# EAGLE design xmos1 (EAGLE 7.6.0)
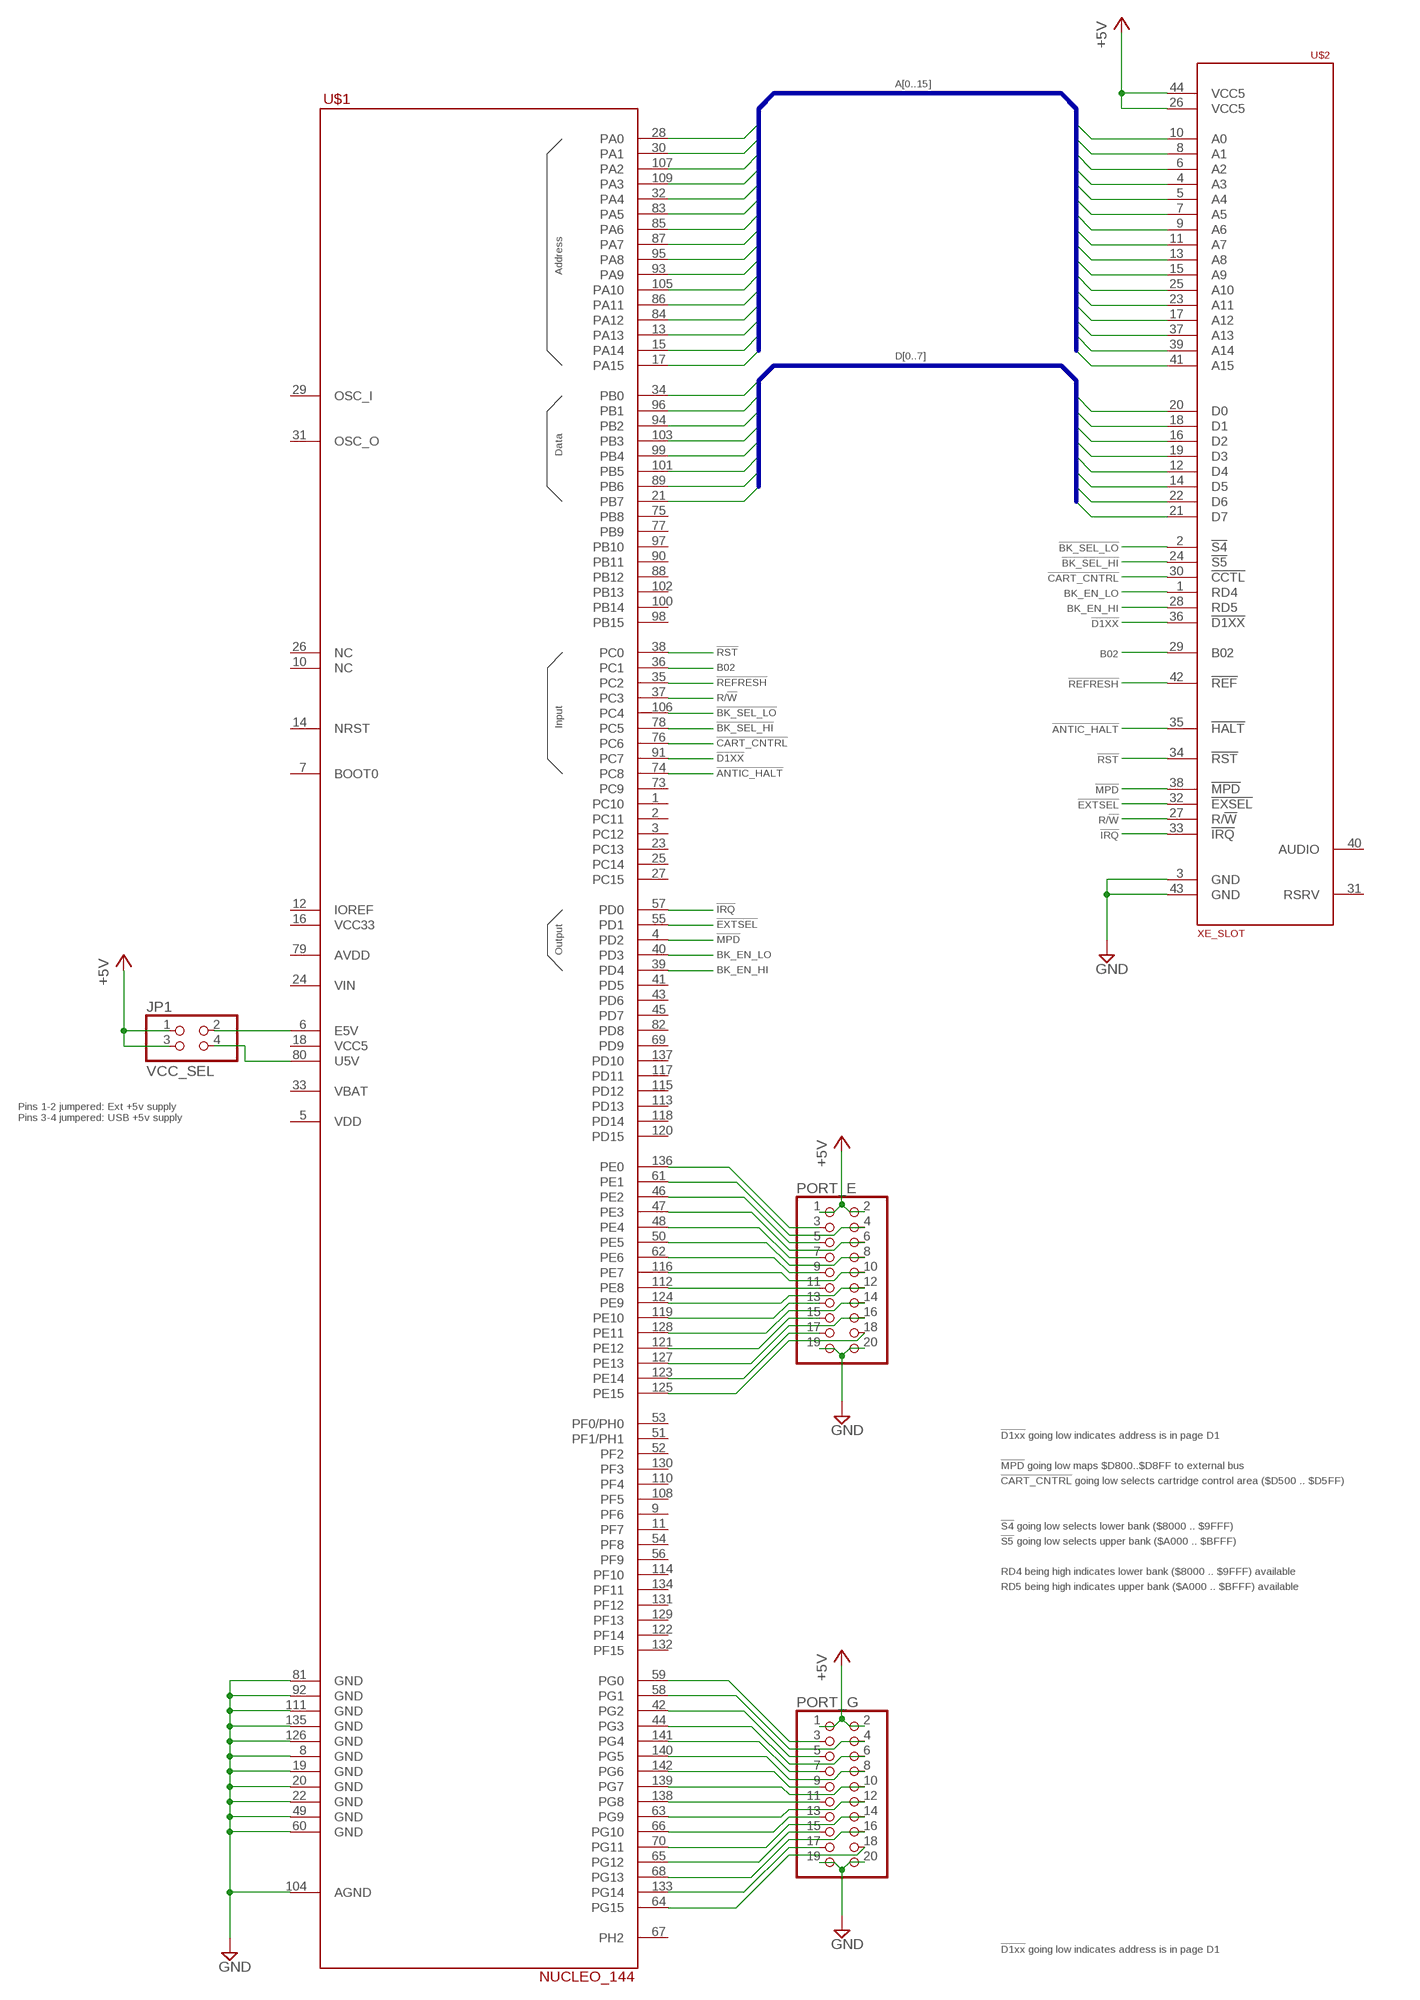
[diagram p0: schematic, sheet 1]

## Parts
JP1  VCC_SEL  PINHD-2X2  [2X02]
PORT_E  PINHD-2X10  [2X10]
PORT_G  PINHD-2X10  [2X10]
U$1  NUCLEO_144  [NUCLEO_144]
U$2  XE_SLOT  [XE_SLOT]

## Nets
!ANTIC_HALT!: U$1.74(PC8) U$2.35(!HALT!)
!BK_SEL_HI!: U$1.78(PC5) U$2.24(!S5!)
!BK_SEL_LO!: U$1.106(PC4) U$2.2(!S4!)
!CART_CNTRL!: U$1.76(PC6) U$2.30(!CCTL!)
!D1XX!: U$1.91(PC7) U$2.36(!D1XX!)
!EXTSEL!: U$1.55(PD1) U$2.32(!EXSEL!)
!IRQ!: U$1.57(PD0) U$2.33(!IRQ!)
!MPD!: U$1.4(PD2) U$2.38(!MPD!)
!REFRESH!: U$1.35(PC2) U$2.42(!REF!)
!RST!: U$1.38(PC0) U$2.34(!RST!)
+5V: JP1.1 JP1.3 PORT_E.1 PORT_E.2 PORT_G.1 PORT_G.2 U$2.26(VCC5) U$2.44(VCC5)
A0: U$1.28(PA0) U$2.10(A0)
A1: U$1.30(PA1) U$2.8(A1)
A2: U$1.107(PA2) U$2.6(A2)
A3: U$1.109(PA3) U$2.4(A3)
A4: U$1.32(PA4) U$2.5(A4)
A5: U$1.83(PA5) U$2.7(A5)
A6: U$1.85(PA6) U$2.9(A6)
A7: U$1.87(PA7) U$2.11(A7)
A8: U$1.95(PA8) U$2.13(A8)
A9: U$1.93(PA9) U$2.15(A9)
A10: U$1.105(PA10) U$2.25(A10)
A11: U$1.86(PA11) U$2.23(A11)
A12: U$1.84(PA12) U$2.17(A12)
A13: U$1.13(PA13) U$2.37(A13)
A14: U$1.15(PA14) U$2.39(A14)
A15: U$1.17(PA15) U$2.41(A15)
B02: U$1.36(PC1) U$2.29(B02)
BK_EN_HI: U$1.39(PD4) U$2.28(RD5)
BK_EN_LO: U$1.40(PD3) U$2.1(RD4)
D0: U$1.34(PB0) U$2.20(D0)
D1: U$1.96(PB1) U$2.18(D1)
D2: U$1.94(PB2) U$2.16(D2)
D3: U$1.103(PB3) U$2.19(D3)
D4: U$1.99(PB4) U$2.12(D4)
D5: U$1.101(PB5) U$2.14(D5)
D6: U$1.89(PB6) U$2.22(D6)
D7: U$1.21(PB7) U$2.21(D7)
GND: PORT_E.19 PORT_E.20 PORT_G.19 PORT_G.20 U$1.8(GND) U$1.19(GND) U$1.20(GND) U$1.22(GND) U$1.49(GND) U$1.60(GND) U$1.81(GND) U$1.92(GND) U$1.104(AGND) U$1.111(GND) U$1.126(GND) U$1.135(GND) U$2.3(GND) U$2.43(GND)
N$1: JP1.2 U$1.6(E5V)
N$2: JP1.4 U$1.80(U5V)
N$3: PORT_E.3 U$1.136(PE0)
N$4: PORT_E.4 U$1.61(PE1)
N$5: PORT_E.5 U$1.46(PE2)
N$6: PORT_E.6 U$1.47(PE3)
N$7: PORT_E.7 U$1.48(PE4)
N$8: PORT_E.8 U$1.50(PE5)
N$9: PORT_E.9 U$1.62(PE6)
N$10: PORT_E.10 U$1.116(PE7)
N$11: PORT_E.11 U$1.112(PE8)
N$12: PORT_E.12 U$1.124(PE9)
N$13: PORT_E.13 U$1.119(PE10)
N$14: PORT_E.14 U$1.128(PE11)
N$15: PORT_E.15 U$1.121(PE12)
N$16: PORT_E.16 U$1.127(PE13)
N$17: PORT_E.17 U$1.123(PE14)
N$18: PORT_E.18 U$1.125(PE15)
N$19: PORT_G.3 U$1.59(PG0)
N$20: PORT_G.4 U$1.58(PG1)
N$21: PORT_G.5 U$1.42(PG2)
N$22: PORT_G.6 U$1.44(PG3)
N$23: PORT_G.7 U$1.141(PG4)
N$24: PORT_G.8 U$1.140(PG5)
N$25: PORT_G.9 U$1.142(PG6)
N$26: PORT_G.11 U$1.138(PG8)
N$28: PORT_G.12 U$1.63(PG9)
N$29: PORT_G.13 U$1.66(PG10)
N$30: PORT_G.14 U$1.70(PG11)
N$31: PORT_G.15 U$1.65(PG12)
N$32: PORT_G.16 U$1.68(PG13)
N$33: PORT_G.17 U$1.133(PG14)
N$34: PORT_G.18 U$1.64(PG15)
PORT_G: PORT_G.10 U$1.139(PG7)
R/!W!: U$1.37(PC3) U$2.27(R/!W!)
Unconnected: U$1.1(PC10) U$1.2(PC11) U$1.3(PC12) U$1.5(VDD) U$1.7(BOOT0) U$1.9(PF6) U$1.10(NC) U$1.11(PF7) U$1.12(IOREF) U$1.14(NRST) U$1.16(VCC33) U$1.18(VCC5) U$1.23(PC13) U$1.24(VIN) U$1.25(PC14) U$1.26(NC) U$1.27(PC15) U$1.29(OSC_I) U$1.31(OSC_O) U$1.33(VBAT) U$1.41(PD5) U$1.43(PD6) U$1.45(PD7) U$1.51(PF1/PH1) U$1.52(PF2) U$1.53(PF0/PH0) U$1.54(PF8) U$1.56(PF9) U$1.67(PH2) U$1.69(PD9) U$1.73(PC9) U$1.75(PB8) U$1.77(PB9) U$1.79(AVDD) U$1.82(PD8) U$1.88(PB12) U$1.90(PB11) U$1.97(PB10) U$1.98(PB15) U$1.100(PB14) U$1.102(PB13) U$1.108(PF5) U$1.110(PF4) U$1.113(PD13) U$1.114(PF10) U$1.115(PD12) U$1.117(PD11) U$1.118(PD14) U$1.120(PD15) U$1.122(PF14) U$1.129(PF13) U$1.130(PF3) U$1.131(PF12) U$1.132(PF15) U$1.134(PF11) U$1.137(PD10) U$2.31(RSRV) U$2.40(AUDIO)

## Buses
A[0..15]
D[0..7]

## Notes on the sheet
- Address
- Data
- Input
- Output
- Pins 1-2 jumpered: Ext +5v supply
  Pins 3-4 jumpered: USB +5v supply
- !D1xx! going low indicates address is in page D1
- !MPD! going low maps $D800..$D8FF to external bus
- !CART_CNTRL! going low selects cartridge control area ($D500 .. $D5FF)
- !S4! going low selects lower bank ($8000 .. $9FFF)
- !S5! going low selects upper bank ($A000 .. $BFFF)
- RD4 being high indicates lower bank ($8000 .. $9FFF) available
- RD5 being high indicates upper bank ($A000 .. $BFFF) available
- !D1xx! going low indicates address is in page D1

## Library data of the parts
JP1 = pinhead:PINHD-2X2: PIN HEADER
PORT_E PORT_G = pinhead:PINHD-2X10: PIN HEADER
U$1 = pbxl:NUCLEO_144
U$2 = pbxl:XE_SLOT

## Board
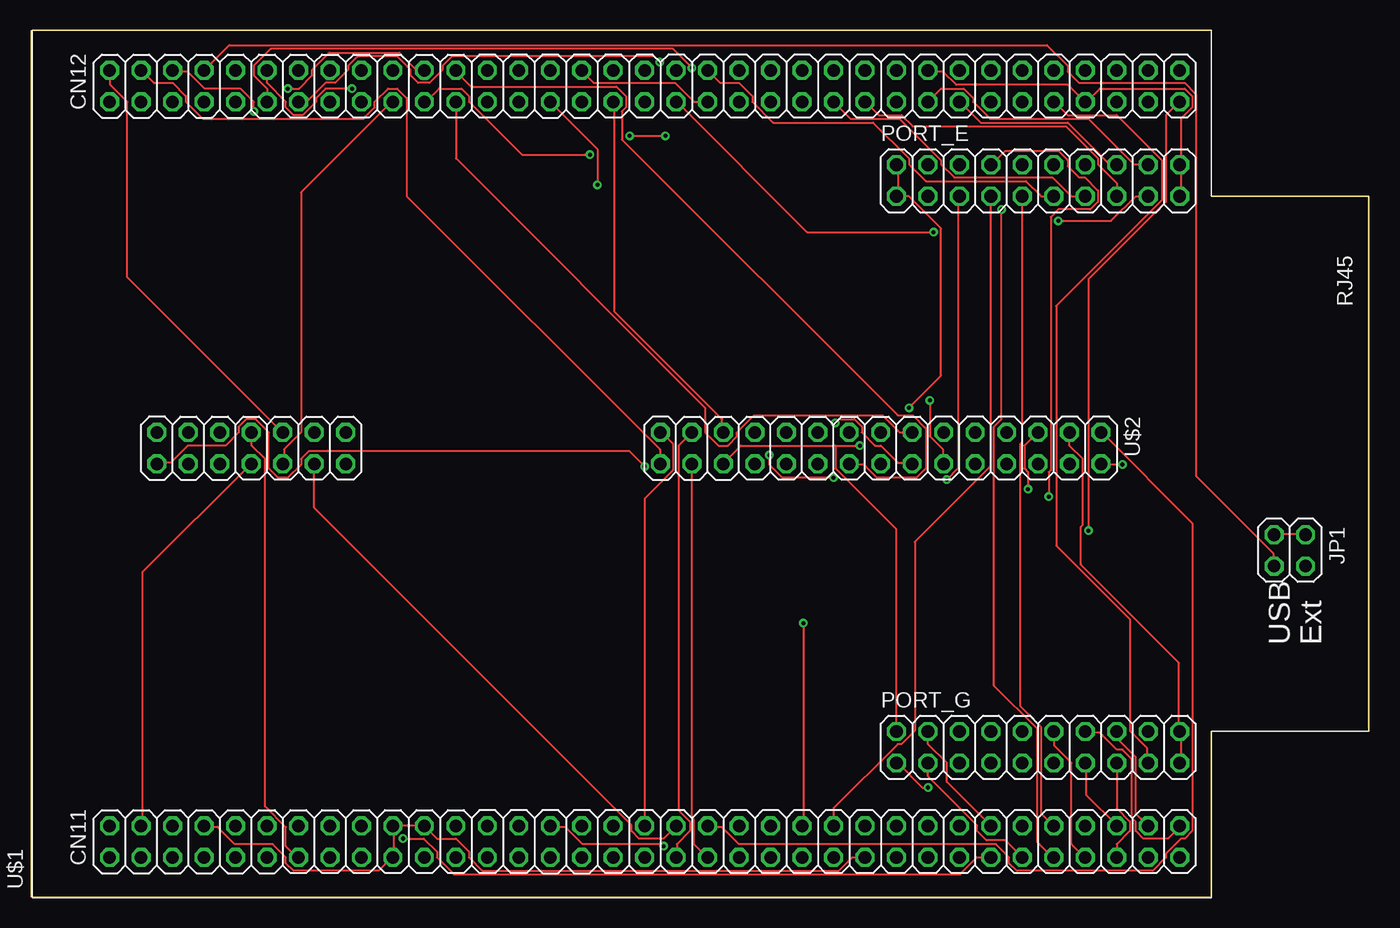
[diagram p1: board, top side]
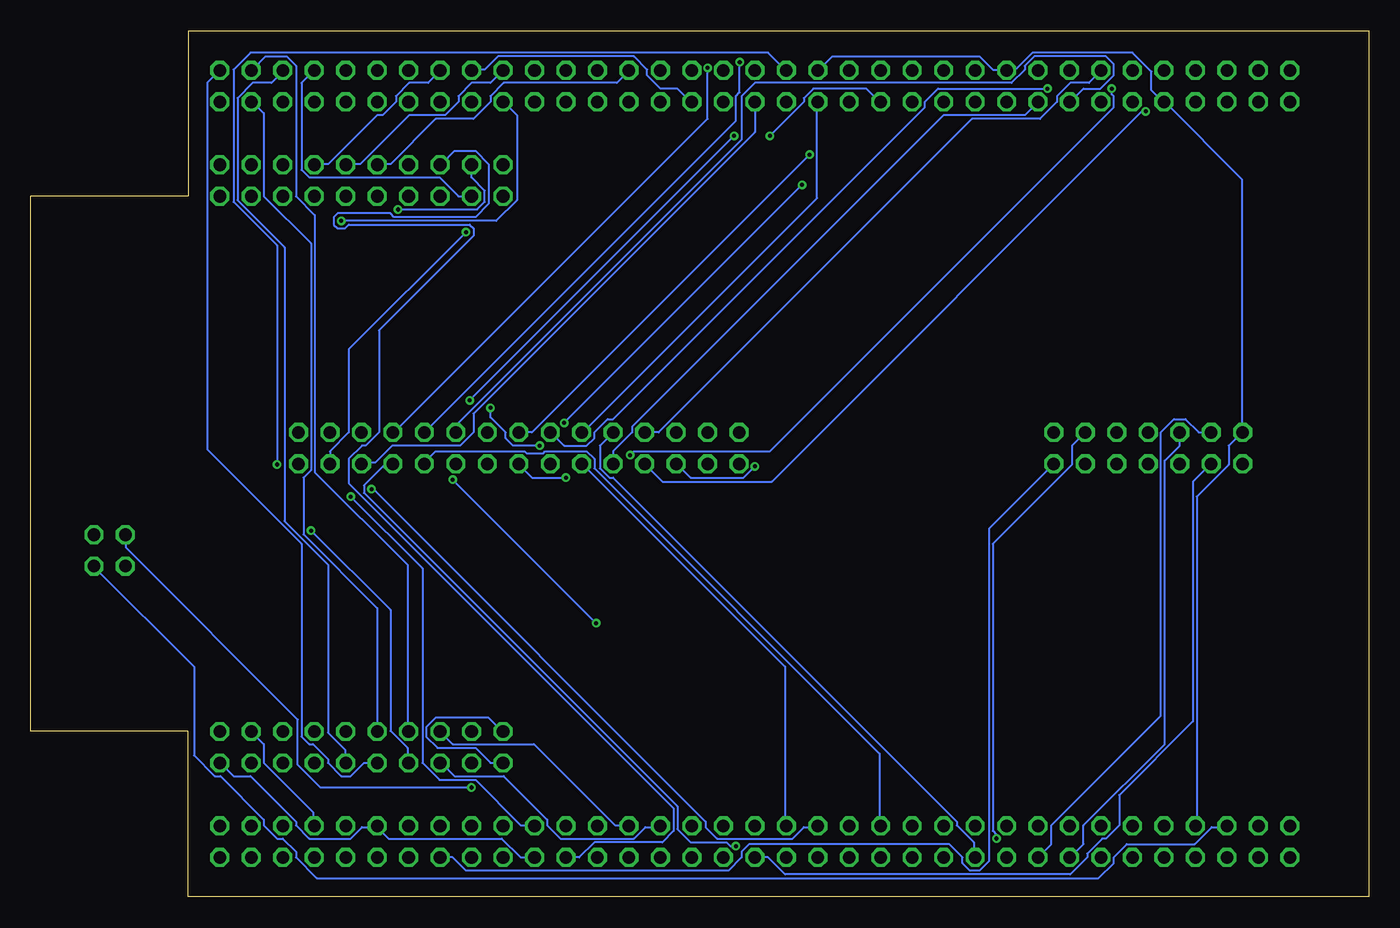
[diagram p2: board, bottom side, seen from below]

Size 107.95 x 69.85 mm. Coordinates in mm from the lower left corner, seen from the top.
Outline: 0,0 95.25,0 95.25,13.34 107.95,13.34 107.95,56.52 95.25,56.52 95.25,69.85 0,69.85 0,0
Copper layers (1*16): Top 0.0356mm / dielectric 1.5011mm / Bottom 0.0356mm
Design rules "oshpark-2layer": minimum track width 6mil, minimum drill 13mil, track to track 6mil, track to pad 6mil, pad to pad 6mil, via to via 6mil, smd to smd 6mil, copper to edge 15mil, drill to drill 6mil, minimum pad ring 7mil, minimum via ring 7mil, stop-mask expansion 2.5mil, vias tented up to drill 0mil, thermal gap 10mil

### Footprints (pad centres in the part's own frame; a part is rotated, then mirrored left to right if it is on the bottom)
2X02 = drill 1.016 octagon: 1 -1.27,-1.27; 2 -1.27,1.27; 3 1.27,-1.27; 4 1.27,1.27
2X10 = drill 1.016 octagon: 1 -11.43,-1.27; 2 -11.43,1.27; 3 -8.89,-1.27; 4 -8.89,1.27; 5 -6.35,-1.27; 6 -6.35,1.27; 7 -3.81,-1.27; 8 -3.81,1.27; 9 -1.27,-1.27; 10 -1.27,1.27; 11 1.27,-1.27; 12 1.27,1.27; 13 3.81,-1.27; 14 3.81,1.27; 15 6.35,-1.27; 16 6.35,1.27; 17 8.89,-1.27; 18 8.89,1.27; 19 11.43,-1.27; 20 11.43,1.27
NUCLEO_144 = drill 1.016 octagon: 1 -34.29,40.64; 2 -31.75,40.64; 3 -34.29,38.1; 4 -31.75,38.1; 5 -34.29,35.56; 6 -31.75,35.56; 7 -34.29,33.02; 8 -31.75,33.02; 9 -34.29,30.48; 10 -31.75,30.48; 11 -34.29,27.94; 12 -31.75,27.94; 13 -34.29,25.4; 14 -31.75,25.4; 15 -34.29,22.86; 16 -31.75,22.86; 17 -34.29,20.32; 18 -31.75,20.32; 19 -34.29,17.78; 20 -31.75,17.78; 21 -34.29,15.24; 22 -31.75,15.24; 23 -34.29,12.7; 24 -31.75,12.7; 25 -34.29,10.16; 26 -31.75,10.16; 27 -34.29,7.62; 28 -31.75,7.62; 29 -34.29,5.08; 30 -31.75,5.08; 31 -34.29,2.54; 32 -31.75,2.54; 33 -34.29,0; 34 -31.75,0; 35 -34.29,-2.54; 36 -31.75,-2.54; 37 -34.29,-5.08; 38 -31.75,-5.08; 39 -34.29,-7.62; 40 -31.75,-7.62; 41 -34.29,-10.16; 42 -31.75,-10.16; 43 -34.29,-12.7; 44 -31.75,-12.7; 45 -34.29,-15.24; 46 -31.75,-15.24; 47 -34.29,-17.78; 48 -31.75,-17.78; 49 -34.29,-20.32; 50 -31.75,-20.32; 51 -34.29,-22.86; 52 -31.75,-22.86; 53 -34.29,-25.4; 54 -31.75,-25.4; 55 -34.29,-27.94; 56 -31.75,-27.94; 57 -34.29,-30.48; 58 -31.75,-30.48; 59 -34.29,-33.02; 60 -31.75,-33.02; 61 -34.29,-35.56; 62 -31.75,-35.56; 63 -34.29,-38.1; 64 -31.75,-38.1; 65 -34.29,-40.64; 66 -31.75,-40.64; 67 -34.29,-43.18; 68 -31.75,-43.18; 69 -34.29,-45.72; 70 -31.75,-45.72; 73 26.67,40.64; 74 29.21,40.64; 75 26.67,38.1; 76 29.21,38.1; 77 26.67,35.56; 78 29.21,35.56; 79 26.67,33.02; 80 29.21,33.02; 81 26.67,30.48; 82 29.21,30.48; 83 26.67,27.94; 84 29.21,27.94; 85 26.67,25.4; 86 29.21,25.4; 87 26.67,22.86; 88 29.21,22.86; 89 26.67,20.32; 90 29.21,20.32; 91 26.67,17.78; 92 29.21,17.78; 93 26.67,15.24; 94 29.21,15.24; 95 26.67,12.7; 96 29.21,12.7; 97 26.67,10.16; 98 29.21,10.16; 99 26.67,7.62; 100 29.21,7.62; 101 26.67,5.08; 102 29.21,5.08; 103 26.67,2.54; 104 29.21,2.54; 105 26.67,0; 106 29.21,0; 107 26.67,-2.54; 108 29.21,-2.54; 109 26.67,-5.08; 110 29.21,-5.08; 111 26.67,-7.62; 112 29.21,-7.62; 113 26.67,-10.16; 114 29.21,-10.16; 115 26.67,-12.7; 116 29.21,-12.7; 117 26.67,-15.24; 118 29.21,-15.24; 119 26.67,-17.78; 120 29.21,-17.78; 121 26.67,-20.32; 122 29.21,-20.32; 123 26.67,-22.86; 124 29.21,-22.86; 125 26.67,-25.4; 126 29.21,-25.4; 127 26.67,-27.94; 128 29.21,-27.94; 129 26.67,-30.48; 130 29.21,-30.48; 131 26.67,-33.02; 132 29.21,-33.02; 133 26.67,-35.56; 134 29.21,-35.56; 135 26.67,-38.1; 136 29.21,-38.1; 137 26.67,-40.64; 138 29.21,-40.64; 139 26.67,-43.18; 140 29.21,-43.18; 141 26.67,-45.72; 142 29.21,-45.72
XE_SLOT = drill 1.016 octagon: 1 -1.27,36.83; 2 1.27,36.83; 3 -1.27,34.29; 4 1.27,34.29; 5 -1.27,31.75; 6 1.27,31.75; 7 -1.27,29.21; 8 1.27,29.21; 9 -1.27,26.67; 10 1.27,26.67; 11 -1.27,24.13; 12 1.27,24.13; 13 -1.27,21.59; 14 1.27,21.59; 15 -1.27,19.05; 16 1.27,19.05; 17 -1.27,16.51; 18 1.27,16.51; 19 -1.27,13.97; 20 1.27,13.97; 21 -1.27,11.43; 22 1.27,11.43; 23 -1.27,8.89; 24 1.27,8.89; 25 -1.27,6.35; 26 1.27,6.35; 27 -1.27,3.81; 28 1.27,3.81; 29 -1.27,1.27; 30 1.27,1.27; 31 -1.27,-24.13; 32 1.27,-24.13; 33 -1.27,-26.67; 34 1.27,-26.67; 35 -1.27,-29.21; 36 1.27,-29.21; 37 -1.27,-31.75; 38 1.27,-31.75; 39 -1.27,-34.29; 40 1.27,-34.29; 41 -1.27,-36.83; 42 1.27,-36.83; 43 -1.27,-39.37; 44 1.27,-39.37

### Placement (x,y rotation side)
JP1  101.6,27.94 180 top
PORT_E  81.28,57.79 0 top
PORT_G  81.28,12.06 0 top
U$1  46.99,37.47 90 top
U$2  49.53,36.2 270 top

### Tracks (layer width: path | path; a pad name or v marks a point on that pad's centre or on a via)
!ANTIC_HALT!
  Top 0.152: U$1.74 6.4,66.57 6.4,65.51 7.77,64.13 7.77,49.96 20.27,37.47 U$2.35
!BK_SEL_HI!  (via drill 0.33)
  Top 0.152: v17.98,63.37 17.98,64.13 16.92,65.2 14.02,65.2 12.65,66.57 11.43,66.57 U$1.78
  Bottom 0.152: v17.98,63.37 18.29,63.37 48.16,33.5 57,33.5 U$2.24
!BK_SEL_LO!  (via drill 0.33)
  Top 0.152: v88.09,34.87 86.41,34.87 U$2.2
  Bottom 0.152: v88.09,34.87 88.09,52.55 91.59,56.06 91.59,66.73 90.22,68.1 48.46,68.1 47.09,66.73 U$1.106
!CART_CNTRL!
  Top 0.152: U$1.76 9.91,65.66 11.43,65.66 12.5,64.59 12.5,64.13 13.87,62.76 26.82,62.76 27.74,63.68 27.74,64.13 28.8,65.2 29.57,65.2 30.33,64.44 30.33,56.52 50.75,36.09 50.75,35.03 U$2.30
!D1XX!
  Top 0.152: U$2.36 20.42,35.03 20.42,36.09 21.79,37.47 21.79,56.82 29.11,64.13 U$1.91
!EXTSEL!
  Bottom 0.152: U$1.55 73.91,3.17 72.85,2.11 51.66,2.11 50.6,3.17 50.6,3.63 49.99,4.24 33.83,4.24 32.77,3.17 32.77,2.72 32.16,2.11 31.39,2.11 30.63,2.87 30.63,29.69 U$2.32
!IRQ!  (via drill 0.33)
  Top 0.152: U$1.57 76.35,3.17 74.98,1.8 34.14,1.8 32.77,3.17 32.77,3.63 31.7,4.7 v30.02,4.7
  Bottom 0.152: v30.02,4.7 30.02,5 30.33,5.31 30.33,28.47 23.93,34.87 23.93,36.4 U$2.33
!MPD!
  Top 0.152: U$1.4 8.99,5.77 8.99,26.19 17.68,34.87 U$2.38
!REFRESH!
  Bottom 0.152: U$1.35 48.46,3.17 47.09,1.8 24.08,1.8 22.71,3.17 22.71,3.48 21.49,4.7 21.18,4.7 20.12,5.77 20.12,8.2 14.17,14.15 14.17,33.5 12.8,34.87 U$2.42
!RST!
  Top 0.152: U$2.34 22.86,31.37 48.46,5.77 48.46,5.31 49.07,4.7 51.05,4.7 U$1.38
+5V  (via drill 0.33)
  Top 0.152: JP1.3 100.43,29.23 102.87,29.23 JP1.1 | v72.39,8.81 71.93,8.81 69.95,10.79 PORT_G.1 | 69.95,56.52 69.95,58.95 PORT_E.2 | v49.53,34.72 48.31,35.94 22.4,35.94 21.79,35.33 21.79,34.87 20.73,33.81 19.96,33.81 19.2,34.57 19.2,37.47 18.14,38.53 17.37,38.53 16.76,37.92 16.76,37.47 15.7,36.4 12.65,36.4 11.28,35.03 10.21,35.03 U$2.44 | 69.95,56.52 70.87,56.52 73.46,53.92 73.46,42.04 v70.87,39.45 | 64.92,36.4 57.3,36.4 55.93,35.03 U$2.26 | 64.92,36.4 v66.9,36.4 | 69.95,56.52 PORT_E.1 | 64.92,36.4 64.92,34.57 69.8,29.69 69.8,13.39 PORT_G.2
  Bottom 0.152: PORT_G.1 70.87,10.79 72.08,12.01 75.13,12.01 76.05,12.93 76.05,13.69 75.29,14.45 71.02,14.45 69.95,13.39 PORT_G.2 | v72.39,8.81 84.58,8.81 86.41,10.64 86.41,14.3 100.28,28.17 100.28,29.08 JP1.3 | v49.53,34.72 50.44,33.81 54.71,33.81 55.78,34.87 U$2.26 | v70.87,39.45 70.87,38.68 69.65,37.47 69.65,37.01 69.04,36.4 v66.9,36.4
A0
  Bottom 0.152: U$1.28 39.47,5.77 39.47,11.56 62.48,34.57 62.48,35.33 63.09,35.94 66.45,35.94 66.6,35.79 67.97,35.79 68.12,35.94 75.29,35.94 76.2,35.03 U$2.10
A1  (via drill 0.33)
  Top 0.152: v51.05,4.09 50.9,4.24 44.5,4.24 43.13,5.61 41.91,5.61 U$1.30
  Bottom 0.152: v51.05,4.09 51.51,4.09 51.82,4.39 54.71,4.39 55.78,5.46 55.78,7.29 81.08,32.59 81.08,33.2 79.4,34.87 78.79,34.87 U$2.8
A2
  Bottom 0.152: U$1.107 49.53,61.7 72.24,38.99 72.24,37.47 73.3,36.4 78.79,36.4 80.16,35.03 81.23,35.03 U$2.6
A3  (via drill 0.33)
  Top 0.152: v72.85,53.62 62.64,53.62 52.12,64.13 U$1.109
  Bottom 0.152: U$2.4 83.82,35.94 82.3,37.47 82.3,44.17 v72.85,53.62
A4  (via drill 0.33)
  Top 0.152: v80.47,32.89 80.47,34.27 80.16,34.57 80.16,36.4 81.23,37.47 U$2.5
  Bottom 0.152: v80.47,32.89 80.31,32.89 53.49,6.07 53.49,5.61 52.58,4.7 46.48,4.7 45.57,5.61 44.5,5.61 U$1.32
A5  (via drill 0.33)
  Top 0.152: U$1.83 19.05,65.2 17.98,66.27 17.98,67.03 19.36,68.4 51.82,68.4 v53.34,66.88
  Bottom 0.152: v53.34,66.88 53.34,62.76 78.64,37.47 U$2.7
A6  (via drill 0.33)
  Top 0.152: U$1.85 22.25,64.13 23.77,65.66 24.54,65.66 25.6,66.73 25.6,67.03 26.36,67.79 29.57,67.79 30.63,66.73 30.63,66.27 31.24,65.66 32.16,65.66 33.22,66.73 33.22,67.03 33.98,67.79 50.29,67.79 v50.75,67.33
  Bottom 0.152: v50.75,67.33 50.75,64.9 51.05,64.59 51.05,62.61 U$2.9
A7
  Bottom 0.152: U$2.11 73.61,37.47 73.61,38.08 50.6,61.09 50.6,64.59 49.53,65.66 28.8,65.66 27.74,66.73 27.74,67.03 26.98,67.79 21.18,67.79 20.57,67.18 20.57,66.27 21.64,65.2 23.01,65.2 24.08,64.13 U$1.87
A8
  Top 0.152: U$2.13 70.1,37.47 68.73,38.84 58.37,38.84 57,37.47 57,37.16 56.24,36.4 55.47,36.4 54.41,37.47 54.41,39.45 34.29,59.56 U$1.95
A9  (via drill 0.33)
  Top 0.152: v45.11,59.87 39.62,59.87 35.36,64.13 35.36,64.59 34.75,65.2 32.92,65.2 31.85,64.13 U$1.93
  Bottom 0.152: U$2.15 67.51,37.47 v45.11,59.87
A10
  Top 0.152: U$1.105 47.09,64.13 47.09,47.22 55.78,38.53 55.78,37.47 U$2.25
A11
  Bottom 0.152: U$2.23 57.3,37.47 32,62.76 26.52,62.76 25.15,64.13 25.15,64.59 24.08,65.66 22.55,65.66 21.64,66.57 U$1.86
A12  (via drill 0.33)
  Top 0.152: U$1.84 19.05,65.66 20.57,64.13 20.57,63.68 21.18,63.07 21.95,63.07 23.01,64.13 23.01,64.44 23.77,65.2 v25.91,65.2
  Bottom 0.152: v25.91,65.2 34.75,65.2 35.81,64.13 35.81,63.68 60.96,38.53 61.42,38.53 62.48,37.47 62.48,37.01 63.09,36.4 64.92,36.4 65.99,37.47 U$2.17
A13
  Top 0.152: U$2.37 17.83,37.47 17.83,36.4 18.9,35.33 18.9,7.29 20.57,5.61 20.57,4.09 21.49,3.17 U$1.13
A14
  Bottom 0.152: U$2.39 15.24,36.4 16.46,35.18 16.46,12.32 23.01,5.77 23.01,4.24 24.08,3.17 U$1.15
A15
  Bottom 0.152: U$2.41 13.72,37.47 14.78,38.53 15.7,38.53 16.76,37.47 16.76,14.61 25.6,5.77 25.6,4.24 U$1.17
B02
  Top 0.152: U$1.36 49.53,32.13 51.82,34.42 51.82,36.55 50.9,37.47 U$2.29
BK_EN_HI
  Top 0.152: U$2.28 53.34,6.38 53.49,6.22 53.49,4.24 54.56,3.17 U$1.39
BK_EN_LO
  Top 0.152: U$1.40 54.71,5.61 55.78,5.61 57.15,4.24 77.88,4.24 78.94,3.17 78.94,2.72 79.55,2.11 90.53,2.11 91.59,3.17 91.59,3.48 92.81,4.7 93.12,4.7 93.73,5.31 93.73,30.15 86.41,37.47 U$2.1
D0
  Bottom 0.152: U$1.34 47.09,5.77 47.09,18.57 63.4,34.87 U$2.20
D1
  Top 0.152: U$2.18 66.14,34.87 67.21,34.87 68.28,33.81 71.48,33.81 72.24,34.57 72.24,37.77 71.17,38.84 69.95,38.84 47.7,61.09 47.7,63.37 48.01,63.68 48.01,64.59 47.24,65.35 35.51,65.35 34.29,66.57 U$1.96
D2  (via drill 0.33)
  Top 0.152: v20.73,65.2 21.64,65.2 22.71,66.27 22.71,66.73 24.08,68.1 29.72,68.1 31.09,66.73 31.7,66.73 U$1.94 | v59.59,35.64 59.59,34.87 60.66,33.81 v64.77,33.81
  Bottom 0.152: v20.73,65.2 20.73,64.74 20.57,64.59 20.57,63.68 48.31,35.94 59.28,35.94 v59.59,35.64 | v64.77,33.81 67.51,33.81 68.58,34.87 U$2.16
D3
  Bottom 0.152: U$1.103 44.5,64.13 44.5,56.36 63.4,37.47 U$2.19
D4  (via drill 0.33)
  Top 0.152: v72.54,40.06 72.54,37.16 73.61,36.09 73.61,35.03 U$2.12 | v48.31,61.39 v51.21,61.39
  Bottom 0.152: v51.21,61.39 v72.54,40.06 | v48.31,61.39 45.57,64.13 45.57,64.44 44.81,65.2 40.54,65.2 39.47,64.13 U$1.99
D5  (via drill 0.33)
  Top 0.152: v64.92,38.23 65.23,38.53 66.45,38.53 67.06,37.92 67.06,37.47 68.12,36.4 68.58,36.4 69.95,35.03 71.02,35.03 U$2.14 | v45.72,57.43 45.72,60.33 U$1.101
  Bottom 0.152: v45.72,57.43 v64.92,38.23
D6
  Bottom 0.152: U$2.22 60.96,35.94 59.44,37.47 59.44,37.92 34.29,63.07 27.74,63.07 U$1.89
D7
  Bottom 0.152: U$2.21 62.03,36.4 62.03,34.57 61.27,33.81 60.96,33.81 33.22,6.07 33.22,5.77 31.85,4.39 31.85,3.17 U$1.21
GND
  Top 0.152: PORT_G.19 92.81,10.79 92.81,13.23 PORT_G.20 92.66,13.39 92.66,18.87 84.73,26.8 84.73,29.84 84.89,30 84.89,35.33 83.82,36.4 U$2.3 | PORT_E.19 92.81,56.52 92.81,58.95 PORT_E.20 92.81,59.11 92.81,62.76 93.73,63.68 93.73,64.59 93.12,65.2 86.26,65.2 85.19,64.13 U$1.135 85.04,64.13 83.67,65.51 74.68,65.51 73.61,66.57 72.39,66.57 U$1.126 | U$1.111 53.49,64.13 51.97,65.66 45.41,65.66 44.5,66.57 U$1.104 | U$1.8 14.02,5.61 15.09,5.61 16.46,4.24 19.51,4.24 20.57,3.17 20.57,2.72 21.18,2.11 28.04,2.11 29.11,3.17 U$1.19 29.26,3.17 29.26,5.61 U$1.20 29.26,5.77 31.7,5.77 U$1.22 32.77,4.7 34.29,4.7 35.36,3.63 35.36,3.17 36.42,2.11 65.23,2.11 66.29,3.17 U$1.49
  Bottom 0.152: U$1.49 68.43,3.17 69.95,4.7 79.1,4.7 80.01,5.61 | 80.01,5.61 81.23,5.61 82.14,4.7 85.5,4.7 86.56,5.77 86.56,6.07 90.22,9.73 91.59,9.73 92.66,10.79 PORT_G.19 | 80.01,5.61 U$1.60 | U$1.104 44.35,66.73 43.28,67.79 31.39,67.79 30.33,66.73 29.26,66.73 U$1.92 29.11,66.73 28.5,66.73 27.13,68.1 19.05,68.1 17.53,66.57 17.53,65.05 16.61,64.13 U$1.81 16.46,64.13 10.21,57.89 10.21,37.47 | 10.21,37.47 11.28,36.4 11.28,34.87 13.87,32.28 13.87,5.77 U$1.8 | 10.21,37.47 U$2.43 | U$1.126 72.39,66.73 71.32,66.73 70.26,67.79 59.28,67.79 58.22,66.73 58.22,66.27 57.15,65.2 55.78,65.2 54.71,64.13 U$1.111
N$1
  Bottom 0.152: U$1.6 11.43,5.61 12.65,5.61 14.02,4.24 19.51,4.24 20.57,3.17 20.57,2.72 21.79,1.5 84.89,1.5 86.56,3.17 86.56,3.63 87.63,4.7 88.09,4.7 89.15,5.77 89.15,6.22 92.66,9.73 93.12,9.73 94.79,11.4 94.79,18.57 102.87,26.64 JP1.2
N$2
  Top 0.152: U$1.80 16,68.71 81.99,68.71 83.67,67.03 83.67,66.57 84.58,65.66 93.12,65.66 94.03,64.74 94.03,33.96 100.28,27.71 100.28,26.8 JP1.4
N$3
  Bottom 0.152: PORT_E.3 73.46,56.52 74.98,58.04 85.5,58.04 86.11,58.65 86.11,65.66 U$1.136
N$4  (via drill 0.33)
  Top 0.152: v78.33,55.45 78.33,38.53 77.72,37.92 77.72,17.04 81.23,13.54 81.23,4.39 82.45,3.17 U$1.61
  Bottom 0.152: PORT_E.4 72.39,58.04 71.32,56.97 71.32,56.06 71.93,55.45 v78.33,55.45
N$5  (via drill 0.33)
  Top 0.152: v62.33,22.07 62.33,5.77 U$1.46 | v73.91,33.66 74.83,34.57 74.83,56.52 PORT_E.5
  Bottom 0.152: v73.91,33.66 v62.33,22.07
N$6
  Bottom 0.152: U$1.47 63.7,3.17 62.48,4.39 57,4.39 56.08,5.31 56.08,7.14 82.3,33.35 82.3,35.33 81.23,36.4 80.92,36.4 79.86,37.47 79.86,45.7 72.24,53.32 72.24,53.92 72.54,54.23 82.3,54.23 82.6,53.92 83.21,53.92 83.52,54.23 83.52,54.84 83.21,55.14 78.94,55.14 78.64,54.84 72.08,54.84 71.02,55.91 71.02,59.11 72.08,60.17 73.76,60.17 74.83,59.11 PORT_E.6
N$7
  Top 0.152: U$1.48 64.77,7.14 69.95,12.32 70.26,12.32 71.32,13.39 71.32,28.63 77.42,34.72 77.42,56.52 PORT_E.7
N$8  (via drill 0.33)
  Top 0.152: v82.14,32.28 82.14,34.27 82.3,34.42 82.3,54.84 82.91,55.45 85.5,55.45 86.11,56.06 86.11,56.97 85.04,58.04 84.58,58.04 83.67,58.95 83.67,59.41 82.91,60.17 78.64,60.17 77.57,59.11 PORT_E.8
  Bottom 0.152: v82.14,32.28 76.35,26.49 76.35,10.79 74.98,9.42 72.08,9.42 68.43,5.77 67.36,5.77 U$1.50
N$9
  Top 0.152: PORT_E.9 80.01,36.7 79.86,36.55 79.86,15.37 81.53,13.69 81.53,6.68 82.45,5.77 U$1.62
N$10
  Bottom 0.152: PORT_E.10 80.01,59.11 78.94,59.11 75.29,62.76 72.24,62.76 70.87,64.13 70.87,64.59 69.8,65.66 60.66,65.66 59.74,66.57 U$1.116
N$11
  Top 0.152: PORT_E.11 81.53,56.52 80.31,57.73 72.24,57.73 70.87,59.11 70.87,59.56 67.97,62.46 59.89,62.46 58.22,64.13 58.22,64.59 57.15,65.66 55.63,65.66 U$1.112
N$12
  Bottom 0.152: U$1.124 70.87,65.66 72.39,65.66 73.46,64.59 73.46,64.13 74.52,63.07 77.42,63.07 81.38,59.11 82.45,59.11 PORT_E.12
N$13
  Top 0.152: PORT_E.13 83.97,56.52 82.45,58.04 74.52,58.04 73.46,59.11 73.46,59.41 70.1,62.76 66.14,62.76 U$1.119
N$14
  Bottom 0.152: PORT_E.14 85.04,59.11 83.97,59.11 80.01,63.07 79.55,63.07 78.49,64.13 78.49,64.59 77.42,65.66 75.89,65.66 74.98,66.57 U$1.128
N$15
  Top 0.152: PORT_E.15 87.63,57.58 86.11,59.11 86.11,59.56 83.52,62.15 71.17,62.15 70.26,63.07 68.43,63.07 67.36,64.13 U$1.121
N$16
  Top 0.152: PORT_E.16 87.63,59.11 87.02,59.11 83.67,62.46 76.66,62.46 74.98,64.13 U$1.127
N$17  (via drill 0.33)
  Top 0.152: PORT_E.17 89.15,56.52 87.17,54.53 v82.91,54.53
  Bottom 0.152: v82.91,54.53 70.41,54.53 68.73,56.21 68.73,63.07 69.8,64.13 U$1.123
N$18
  Top 0.152: U$1.125 73.46,65.2 75.29,65.2 76.05,64.44 76.05,64.13 77.42,62.76 85.34,62.76 89,59.11 90.07,59.11 PORT_E.18
N$19
  Top 0.152: PORT_G.3 72.39,9.73 76.35,5.77 76.35,5.31 77.11,4.55 78.64,4.55 U$1.59
N$20
  Top 0.152: PORT_G.4 72.39,12.32 73.91,10.79 73.91,9.27 U$1.58
N$21
  Bottom 0.152: U$1.42 57.15,5.61 58.37,5.61 59.28,4.7 65.23,4.7 66.29,5.77 66.29,6.22 69.8,9.73 73.76,9.73 74.83,10.79 PORT_G.5
N$22
  Bottom 0.152: PORT_G.6 73.91,12.32 67.36,12.32 60.81,5.77 59.74,5.77 U$1.44
N$23  (via drill 0.33)
  Top 0.152: v85.34,29.54 85.34,49.81 91.59,56.06 91.59,63.07 92.66,64.13 U$1.141
  Bottom 0.152: v85.34,29.54 78.94,23.14 78.94,13.39 77.57,12.01 77.57,10.79 PORT_G.7
N$24
  Bottom 0.152: PORT_G.8 77.57,13.39 77.57,26.8 85.04,34.27 85.04,54.99 86.56,56.52 86.56,67.03 87.33,67.79 89,67.79 90.07,66.73 U$1.140
N$25
  Bottom 0.152: PORT_G.9 81.08,10.79 82.14,9.73 82.91,9.73 83.97,10.79 83.97,11.1 85.19,12.32 85.5,12.32 86.11,12.93 86.11,28.47 93.73,36.09 93.73,65.66 U$1.142
N$26
  Bottom 0.152: PORT_G.11 82.6,10.79 82.6,11.86 83.97,13.23 83.97,26.8 87.48,30.3 87.48,52.4 91.29,56.21 91.29,64.44 90.07,65.66 88.54,65.66 87.63,66.57 U$1.138
N$28
  Top 0.152: PORT_G.12 82.6,13.23 82.6,12.17 83.97,10.79 83.97,4.24 85.04,3.17 U$1.63
N$29
  Top 0.152: PORT_G.13 85.19,10.79 85.19,8.2 87.63,5.77 U$1.66
N$30
  Top 0.152: PORT_G.14 85.19,13.23 86.26,13.23 87.63,11.86 88.09,11.86 88.85,11.1 88.85,6.38 89.15,6.07 89.15,5.31 89.76,4.7 91.75,4.7 92.66,5.61 U$1.70
N$31
  Top 0.152: U$1.65 87.63,4.24 88.7,5.31 88.7,6.07 87.63,7.14 PORT_G.15
N$32
  Top 0.152: PORT_G.16 87.63,12.78 89.15,11.25 89.15,6.68 90.07,5.77 U$1.68
N$33
  Top 0.152: PORT_G.17 90.07,10.79 90.07,12.01 88.7,13.39 88.7,22.38 82.75,28.32 82.75,47.68 91.29,56.21 91.29,59.41 87.63,63.07 83.67,63.07 82.6,64.13 U$1.133
N$34
  Bottom 0.152: PORT_G.18 89.15,12.32 89.15,10.79 85.19,6.83 85.19,5.77 U$1.64
PORT_G
  Bottom 0.152: PORT_G.10 80.01,23.29 85.95,29.23 85.95,33.81 85.34,34.42 85.34,52.71 89.15,56.52 89.15,63.22 90.07,64.13 U$1.139
R/!W!
  Top 0.152: U$2.27 52.27,36.4 52.27,6.99 53.19,6.07 53.19,5.31 52.12,4.24 52.12,3.17 U$1.37

### Text on the board
tPlace: USB | Ext